# Altium project PCB_Project.PrjPcb (part 4 of 5)
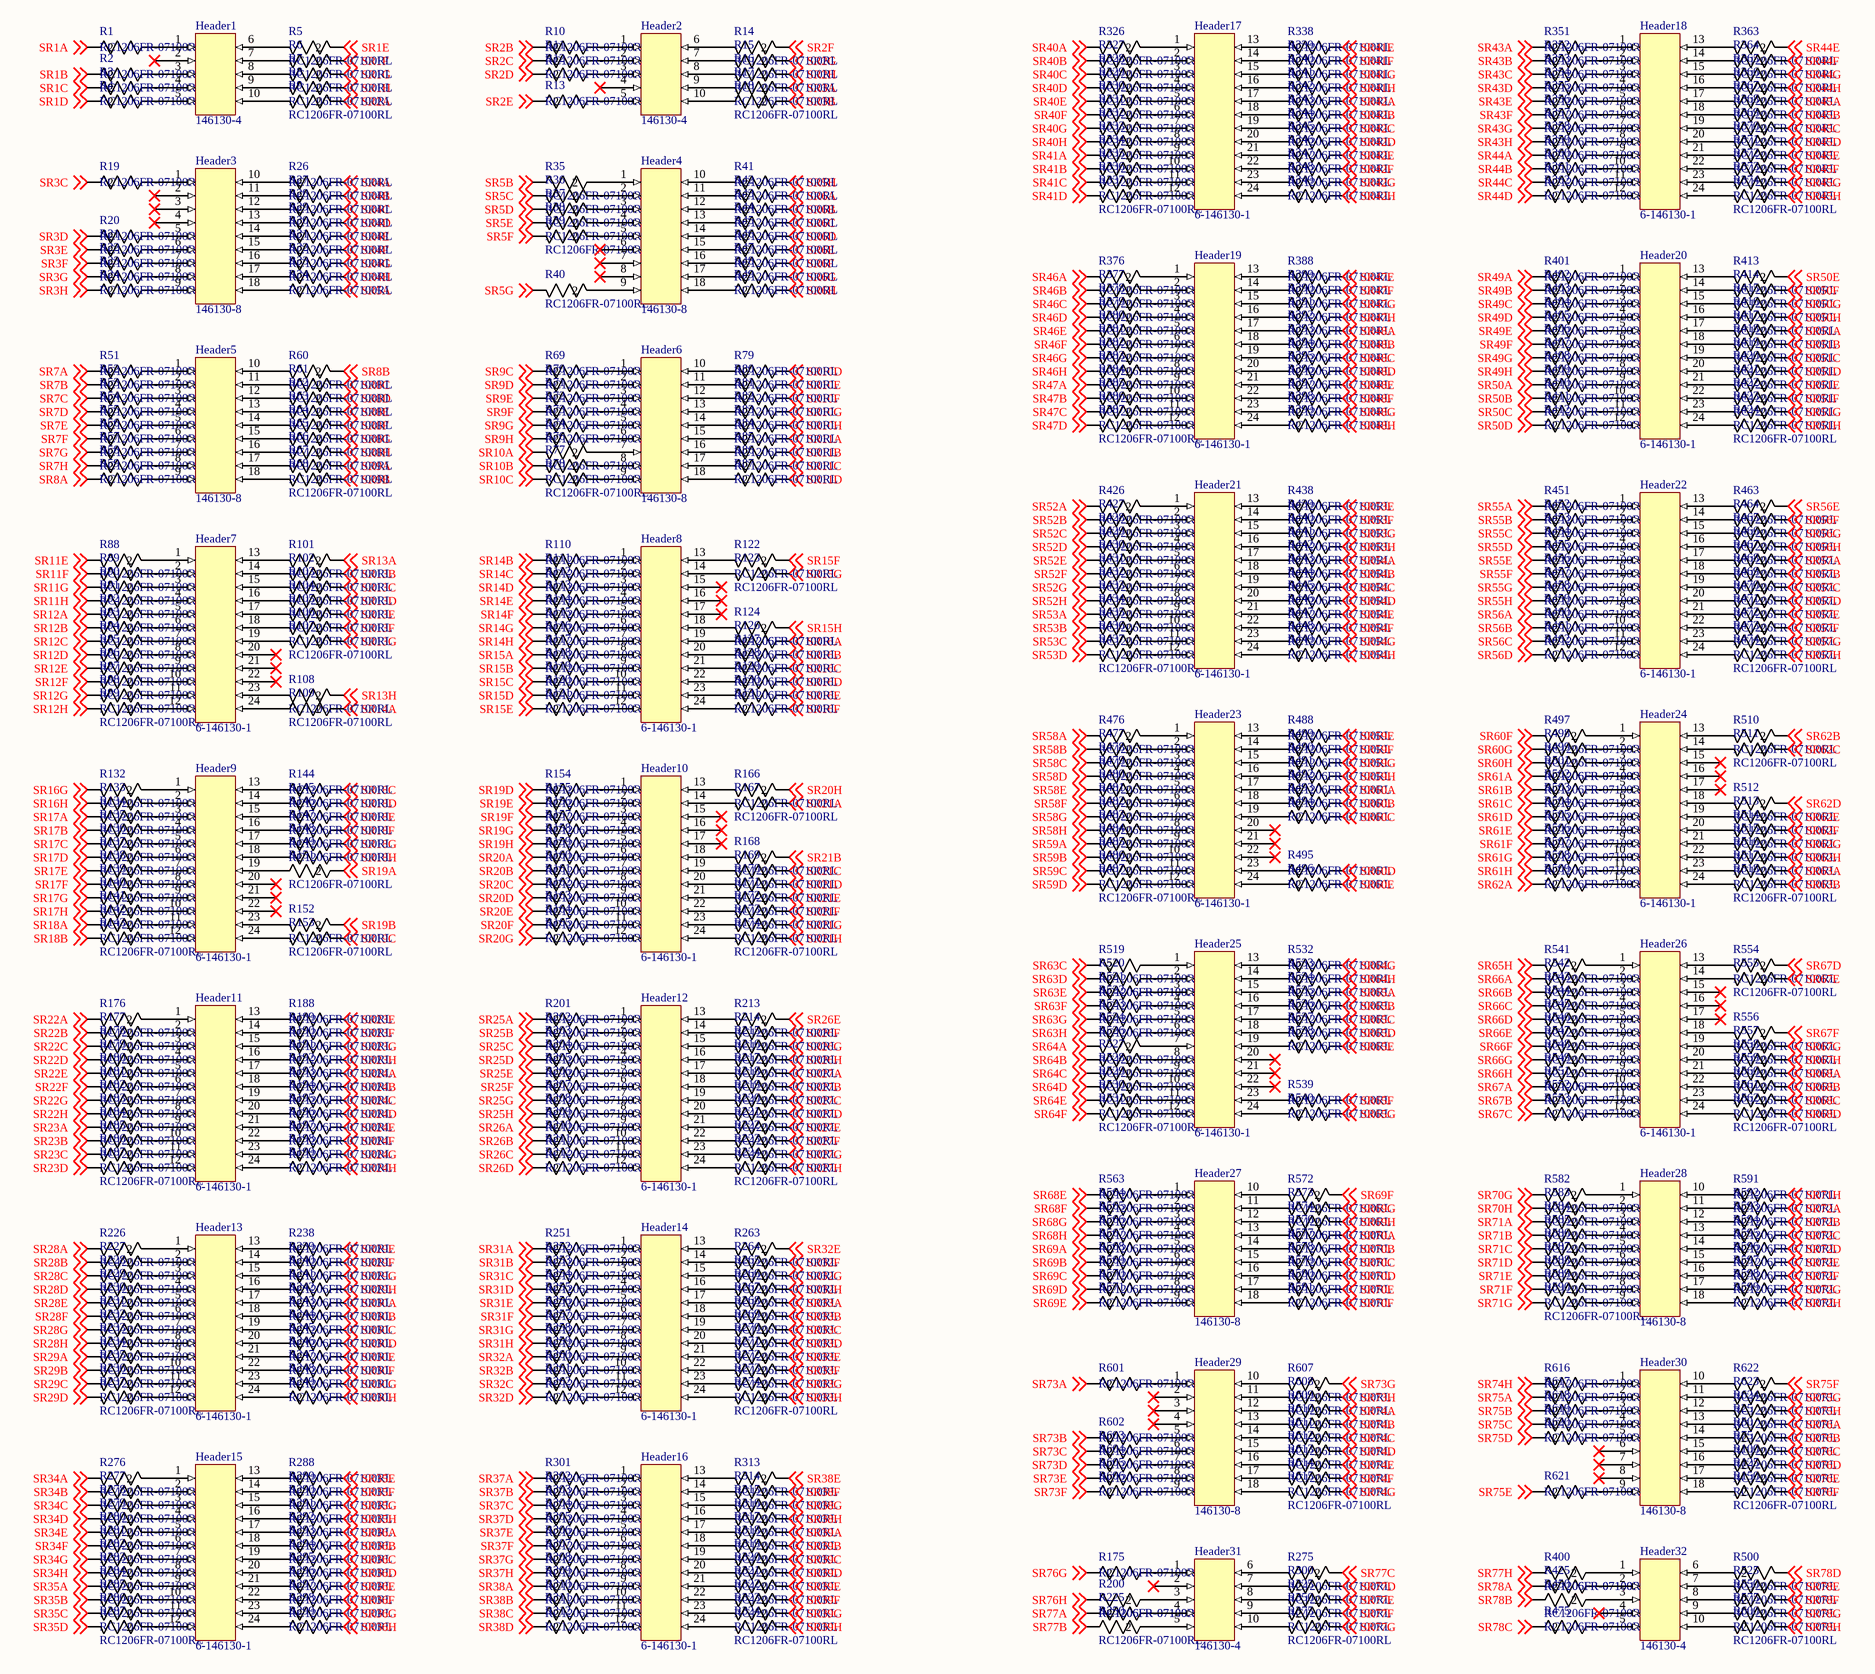
[diagram p9: digital_PIN_interface.SchDoc]

## Sheet digital_PIN_interface.SchDoc (continued)

### Nets
SR1A: R1.2 ; off-sheet SR1A
SR1B: R2.2 ; off-sheet SR1B
SR1C: R3.2 ; off-sheet SR1C
SR1D: R4.2 ; off-sheet SR1D
SR1E: R5.2 ; off-sheet SR1E
SR1F: R6.2 ; off-sheet SR1F
SR1G: R7.2 ; off-sheet SR1G
SR1H: R8.2 ; off-sheet SR1H
SR2A: R9.2 ; off-sheet SR2A
SR2B: R10.2 ; off-sheet SR2B
SR2C: R11.2 ; off-sheet SR2C
SR2D: R12.2 ; off-sheet SR2D
SR2E: R13.2 ; off-sheet SR2E
SR2F: R14.2 ; off-sheet SR2F
SR2G: R15.2 ; off-sheet SR2G
SR2H: R16.2 ; off-sheet SR2H
SR3A: R17.2 ; off-sheet SR3A
SR3B: R18.2 ; off-sheet SR3B
SR3C: R19.2 ; off-sheet SR3C
SR3D: R20.2 ; off-sheet SR3D
SR3E: R21.2 ; off-sheet SR3E
SR3F: R22.2 ; off-sheet SR3F
SR3G: R23.2 ; off-sheet SR3G
SR3H: R24.2 ; off-sheet SR3H
SR4A: R26.1 ; off-sheet SR4A
SR4B: R27.1 ; off-sheet SR4B
SR4C: R28.1 ; off-sheet SR4C
SR4D: R29.1 ; off-sheet SR4D
SR4E: R30.1 ; off-sheet SR4E
SR4F: R31.1 ; off-sheet SR4F
SR4G: R32.1 ; off-sheet SR4G
SR4H: R33.1 ; off-sheet SR4H
SR5A: R34.1 ; off-sheet SR5A
SR5B: R35.1 ; off-sheet SR5B
SR5C: R36.1 ; off-sheet SR5C
SR5D: R37.1 ; off-sheet SR5D
SR5E: R38.1 ; off-sheet SR5E
SR5F: R39.1 ; off-sheet SR5F
SR5G: R40.1 ; off-sheet SR5G
SR5H: R41.1 ; off-sheet SR5H
SR6A: R42.1 ; off-sheet SR6A
SR6B: R43.1 ; off-sheet SR6B
SR6C: R44.1 ; off-sheet SR6C
SR6D: R45.1 ; off-sheet SR6D
SR6E: R46.1 ; off-sheet SR6E
SR6F: R47.1 ; off-sheet SR6F
SR6G: R48.1 ; off-sheet SR6G
SR6H: R49.1 ; off-sheet SR6H
SR7A: R51.2 ; off-sheet SR7A
SR7B: R52.2 ; off-sheet SR7B
SR7C: R53.2 ; off-sheet SR7C
SR7D: R54.2 ; off-sheet SR7D
SR7E: R55.2 ; off-sheet SR7E
SR7F: R56.2 ; off-sheet SR7F
SR7G: R57.2 ; off-sheet SR7G
SR7H: R58.2 ; off-sheet SR7H
SR8A: R59.2 ; off-sheet SR8A
SR8B: R60.2 ; off-sheet SR8B
SR8C: R61.2 ; off-sheet SR8C
SR8D: R62.2 ; off-sheet SR8D
SR8E: R63.2 ; off-sheet SR8E
SR8F: R64.2 ; off-sheet SR8F
SR8G: R65.2 ; off-sheet SR8G
SR8H: R66.2 ; off-sheet SR8H
SR9A: R67.2 ; off-sheet SR9A
SR9B: R68.2 ; off-sheet SR9B
SR9C: R69.2 ; off-sheet SR9C
SR9D: R70.2 ; off-sheet SR9D
SR9E: R71.2 ; off-sheet SR9E
SR9F: R72.2 ; off-sheet SR9F
SR9G: R73.2 ; off-sheet SR9G
SR9H: R74.2 ; off-sheet SR9H
SR10A: R76.1 ; off-sheet SR10A
SR10B: R77.1 ; off-sheet SR10B
SR10C: R78.1 ; off-sheet SR10C
SR10D: R79.1 ; off-sheet SR10D
SR10E: R80.1 ; off-sheet SR10E
SR10F: R81.1 ; off-sheet SR10F
SR10G: R82.1 ; off-sheet SR10G
SR10H: R83.1 ; off-sheet SR10H
SR11A: R84.1 ; off-sheet SR11A
SR11B: R85.1 ; off-sheet SR11B
SR11C: R86.1 ; off-sheet SR11C
SR11D: R87.1 ; off-sheet SR11D
SR11E: R88.1 ; off-sheet SR11E
SR11F: R89.1 ; off-sheet SR11F
SR11G: R90.1 ; off-sheet SR11G
SR11H: R91.1 ; off-sheet SR11H
SR12A: R92.1 ; off-sheet SR12A
SR12B: R93.1 ; off-sheet SR12B
SR12C: R94.1 ; off-sheet SR12C
SR12D: R95.1 ; off-sheet SR12D
SR12E: R96.1 ; off-sheet SR12E
SR12F: R97.1 ; off-sheet SR12F
SR12G: R98.1 ; off-sheet SR12G
SR12H: R99.1 ; off-sheet SR12H
SR13A: R101.2 ; off-sheet SR13A
SR13B: R102.2 ; off-sheet SR13B
SR13C: R103.2 ; off-sheet SR13C
SR13D: R104.2 ; off-sheet SR13D
SR13E: R105.2 ; off-sheet SR13E
SR13F: R106.2 ; off-sheet SR13F
SR13G: R107.2 ; off-sheet SR13G
SR13H: R108.2 ; off-sheet SR13H
SR14A: R109.2 ; off-sheet SR14A
SR14B: R110.2 ; off-sheet SR14B
SR14C: R111.2 ; off-sheet SR14C
SR14D: R112.2 ; off-sheet SR14D
SR14E: R113.2 ; off-sheet SR14E
SR14F: R114.2 ; off-sheet SR14F
SR14G: R115.2 ; off-sheet SR14G
SR14H: R116.2 ; off-sheet SR14H
SR15A: R117.2 ; off-sheet SR15A
SR15B: R118.2 ; off-sheet SR15B
SR15C: R119.2 ; off-sheet SR15C
SR15D: R120.2 ; off-sheet SR15D
SR15E: R121.2 ; off-sheet SR15E
SR15F: R122.2 ; off-sheet SR15F
SR15G: R123.2 ; off-sheet SR15G
SR15H: R124.2 ; off-sheet SR15H
SR16A: R126.1 ; off-sheet SR16A
SR16B: R127.1 ; off-sheet SR16B
SR16C: R128.1 ; off-sheet SR16C
SR16D: R129.1 ; off-sheet SR16D
SR16E: R130.1 ; off-sheet SR16E
SR16F: R131.1 ; off-sheet SR16F
SR16G: R132.1 ; off-sheet SR16G
SR16H: R133.1 ; off-sheet SR16H
SR17A: R134.1 ; off-sheet SR17A
SR17B: R135.1 ; off-sheet SR17B
SR17C: R136.1 ; off-sheet SR17C
SR17D: R137.1 ; off-sheet SR17D
SR17E: R138.1 ; off-sheet SR17E
SR17F: R139.1 ; off-sheet SR17F
SR17G: R140.1 ; off-sheet SR17G
SR17H: R141.1 ; off-sheet SR17H
SR18A: R142.1 ; off-sheet SR18A
SR18B: R143.1 ; off-sheet SR18B
SR18C: R144.1 ; off-sheet SR18C
SR18D: R145.1 ; off-sheet SR18D
SR18E: R146.1 ; off-sheet SR18E
SR18F: R147.1 ; off-sheet SR18F
SR18G: R148.1 ; off-sheet SR18G
SR18H: R149.1 ; off-sheet SR18H
SR19A: R151.2 ; off-sheet SR19A
SR19B: R152.2 ; off-sheet SR19B
SR19C: R153.2 ; off-sheet SR19C
SR19D: R154.2 ; off-sheet SR19D
SR19E: R155.2 ; off-sheet SR19E
SR19F: R156.2 ; off-sheet SR19F
SR19G: R157.2 ; off-sheet SR19G
SR19H: R158.2 ; off-sheet SR19H
SR20A: R159.2 ; off-sheet SR20A
SR20B: R160.2 ; off-sheet SR20B
SR20C: R161.2 ; off-sheet SR20C
SR20D: R162.2 ; off-sheet SR20D
SR20E: R163.2 ; off-sheet SR20E
SR20F: R164.2 ; off-sheet SR20F
SR20G: R165.2 ; off-sheet SR20G
SR20H: R166.2 ; off-sheet SR20H
SR21A: R167.2 ; off-sheet SR21A
SR21B: R168.2 ; off-sheet SR21B
SR21C: R169.2 ; off-sheet SR21C
SR21D: R170.2 ; off-sheet SR21D
SR21E: R171.2 ; off-sheet SR21E
SR21F: R172.2 ; off-sheet SR21F
SR21G: R173.2 ; off-sheet SR21G
SR21H: R174.2 ; off-sheet SR21H
SR22A: R176.1 ; off-sheet SR22A
SR22B: R177.1 ; off-sheet SR22B
SR22C: R178.1 ; off-sheet SR22C
SR22D: R179.1 ; off-sheet SR22D
SR22E: R180.1 ; off-sheet SR22E
SR22F: R181.1 ; off-sheet SR22F
SR22G: R182.1 ; off-sheet SR22G
SR22H: R183.1 ; off-sheet SR22H
SR23A: R184.1 ; off-sheet SR23A
SR23B: R185.1 ; off-sheet SR23B
SR23C: R186.1 ; off-sheet SR23C
SR23D: R187.1 ; off-sheet SR23D
SR23E: R188.1 ; off-sheet SR23E
SR23F: R189.1 ; off-sheet SR23F
SR23G: R190.1 ; off-sheet SR23G
SR23H: R191.1 ; off-sheet SR23H
SR24A: R192.1 ; off-sheet SR24A
SR24B: R193.1 ; off-sheet SR24B
SR24C: R194.1 ; off-sheet SR24C
SR24D: R195.1 ; off-sheet SR24D
SR24E: R196.1 ; off-sheet SR24E
SR24F: R197.1 ; off-sheet SR24F
SR24G: R198.1 ; off-sheet SR24G
SR24H: R199.1 ; off-sheet SR24H
SR25A: R201.2 ; off-sheet SR25A
SR25B: R202.2 ; off-sheet SR25B
SR25C: R203.2 ; off-sheet SR25C
SR25D: R204.2 ; off-sheet SR25D
SR25E: R205.2 ; off-sheet SR25E
SR25F: R206.2 ; off-sheet SR25F
SR25G: R207.2 ; off-sheet SR25G
SR25H: R208.2 ; off-sheet SR25H
SR26A: R209.2 ; off-sheet SR26A
SR26B: R210.2 ; off-sheet SR26B
SR26C: R211.2 ; off-sheet SR26C
SR26D: R212.2 ; off-sheet SR26D
SR26E: R213.2 ; off-sheet SR26E
SR26F: R214.2 ; off-sheet SR26F
SR26G: R215.2 ; off-sheet SR26G
SR26H: R216.2 ; off-sheet SR26H
SR27A: R217.2 ; off-sheet SR27A
SR27B: R218.2 ; off-sheet SR27B
SR27C: R219.2 ; off-sheet SR27C
SR27D: R220.2 ; off-sheet SR27D
SR27E: R221.2 ; off-sheet SR27E
SR27F: R222.2 ; off-sheet SR27F
SR27G: R223.2 ; off-sheet SR27G
SR27H: R224.2 ; off-sheet SR27H
SR28A: R226.1 ; off-sheet SR28A
SR28B: R227.1 ; off-sheet SR28B
SR28C: R228.1 ; off-sheet SR28C
SR28D: R229.1 ; off-sheet SR28D
SR28E: R230.1 ; off-sheet SR28E
SR28F: R231.1 ; off-sheet SR28F
SR28G: R232.1 ; off-sheet SR28G
SR28H: R233.1 ; off-sheet SR28H
SR29A: R234.1 ; off-sheet SR29A
SR29B: R235.1 ; off-sheet SR29B
SR29C: R236.1 ; off-sheet SR29C
SR29D: R237.1 ; off-sheet SR29D
SR29E: R238.1 ; off-sheet SR29E
SR29F: R239.1 ; off-sheet SR29F
SR29G: R240.1 ; off-sheet SR29G
SR29H: R241.1 ; off-sheet SR29H
SR30A: R242.1 ; off-sheet SR30A
SR30B: R243.1 ; off-sheet SR30B
SR30C: R244.1 ; off-sheet SR30C
SR30D: R245.1 ; off-sheet SR30D
SR30E: R246.1 ; off-sheet SR30E
SR30F: R247.1 ; off-sheet SR30F
SR30G: R248.1 ; off-sheet SR30G
SR30H: R249.1 ; off-sheet SR30H
SR31A: R251.2 ; off-sheet SR31A
SR31B: R252.2 ; off-sheet SR31B
SR31C: R253.2 ; off-sheet SR31C
SR31D: R254.2 ; off-sheet SR31D
SR31E: R255.2 ; off-sheet SR31E
SR31F: R256.2 ; off-sheet SR31F
SR31G: R257.2 ; off-sheet SR31G
SR31H: R258.2 ; off-sheet SR31H
SR32A: R259.2 ; off-sheet SR32A
SR32B: R260.2 ; off-sheet SR32B
SR32C: R261.2 ; off-sheet SR32C
SR32D: R262.2 ; off-sheet SR32D
SR32E: R263.2 ; off-sheet SR32E
SR32F: R264.2 ; off-sheet SR32F
SR32G: R265.2 ; off-sheet SR32G
SR32H: R266.2 ; off-sheet SR32H
SR33A: R267.2 ; off-sheet SR33A
SR33B: R268.2 ; off-sheet SR33B
SR33C: R269.2 ; off-sheet SR33C
SR33D: R270.2 ; off-sheet SR33D
SR33E: R271.2 ; off-sheet SR33E
SR33F: R272.2 ; off-sheet SR33F
SR33G: R273.2 ; off-sheet SR33G
SR33H: R274.2 ; off-sheet SR33H
SR34A: R276.1 ; off-sheet SR34A
SR34B: R277.1 ; off-sheet SR34B
SR34C: R278.1 ; off-sheet SR34C
SR34D: R279.1 ; off-sheet SR34D
SR34E: R280.1 ; off-sheet SR34E
SR34F: R281.1 ; off-sheet SR34F
SR34G: R282.1 ; off-sheet SR34G
SR34H: R283.1 ; off-sheet SR34H
SR35A: R284.1 ; off-sheet SR35A
SR35B: R285.1 ; off-sheet SR35B
SR35C: R286.1 ; off-sheet SR35C
SR35D: R287.1 ; off-sheet SR35D
SR35E: R288.1 ; off-sheet SR35E
SR35F: R289.1 ; off-sheet SR35F
SR35G: R290.1 ; off-sheet SR35G
SR35H: R291.1 ; off-sheet SR35H
SR36A: R292.1 ; off-sheet SR36A
SR36B: R293.1 ; off-sheet SR36B
SR36C: R294.1 ; off-sheet SR36C
SR36D: R295.1 ; off-sheet SR36D
SR36E: R296.1 ; off-sheet SR36E
SR36F: R297.1 ; off-sheet SR36F
SR36G: R298.1 ; off-sheet SR36G
SR36H: R299.1 ; off-sheet SR36H
SR37A: R301.2 ; off-sheet SR37A
SR37B: R302.2 ; off-sheet SR37B
SR37C: R303.2 ; off-sheet SR37C
SR37D: R304.2 ; off-sheet SR37D
SR37E: R305.2 ; off-sheet SR37E
SR37F: R306.2 ; off-sheet SR37F
SR37G: R307.2 ; off-sheet SR37G
SR37H: R308.2 ; off-sheet SR37H
SR38A: R309.2 ; off-sheet SR38A
SR38B: R310.2 ; off-sheet SR38B
SR38C: R311.2 ; off-sheet SR38C
SR38D: R312.2 ; off-sheet SR38D
SR38E: R313.2 ; off-sheet SR38E
SR38F: R314.2 ; off-sheet SR38F
SR38G: R315.2 ; off-sheet SR38G
SR38H: R316.2 ; off-sheet SR38H
SR39A: R317.2 ; off-sheet SR39A
SR39B: R318.2 ; off-sheet SR39B
SR39C: R319.2 ; off-sheet SR39C
SR39D: R320.2 ; off-sheet SR39D
SR39E: R321.2 ; off-sheet SR39E
SR39F: R322.2 ; off-sheet SR39F
SR39G: R323.2 ; off-sheet SR39G
SR39H: R324.2 ; off-sheet SR39H
SR40A: R326.1 ; off-sheet SR40A
SR40B: R327.1 ; off-sheet SR40B
SR40C: R328.1 ; off-sheet SR40C
SR40D: R329.1 ; off-sheet SR40D
SR40E: R330.1 ; off-sheet SR40E
SR40F: R331.1 ; off-sheet SR40F
SR40G: R332.1 ; off-sheet SR40G
SR40H: R333.1 ; off-sheet SR40H
SR41A: R334.1 ; off-sheet SR41A
SR41B: R335.1 ; off-sheet SR41B
SR41C: R336.1 ; off-sheet SR41C
SR41D: R337.1 ; off-sheet SR41D
SR41E: R338.1 ; off-sheet SR41E
SR41F: R339.1 ; off-sheet SR41F
SR41G: R340.1 ; off-sheet SR41G
SR41H: R341.1 ; off-sheet SR41H
SR42A: R342.1 ; off-sheet SR42A
SR42B: R343.1 ; off-sheet SR42B
SR42C: R344.1 ; off-sheet SR42C
SR42D: R345.1 ; off-sheet SR42D
SR42E: R346.1 ; off-sheet SR42E
SR42F: R347.1 ; off-sheet SR42F
SR42G: R348.1 ; off-sheet SR42G
SR42H: R349.1 ; off-sheet SR42H
SR43A: R351.2 ; off-sheet SR43A
SR43B: R352.2 ; off-sheet SR43B
SR43C: R353.2 ; off-sheet SR43C
SR43D: R354.2 ; off-sheet SR43D
SR43E: R355.2 ; off-sheet SR43E
SR43F: R356.2 ; off-sheet SR43F
SR43G: R357.2 ; off-sheet SR43G
SR43H: R358.2 ; off-sheet SR43H
SR44A: R359.2 ; off-sheet SR44A
SR44B: R360.2 ; off-sheet SR44B
SR44C: R361.2 ; off-sheet SR44C
SR44D: R362.2 ; off-sheet SR44D
SR44E: R363.2 ; off-sheet SR44E
SR44F: R364.2 ; off-sheet SR44F
SR44G: R365.2 ; off-sheet SR44G
SR44H: R366.2 ; off-sheet SR44H
SR45A: R367.2 ; off-sheet SR45A
SR45B: R368.2 ; off-sheet SR45B
SR45C: R369.2 ; off-sheet SR45C
SR45D: R370.2 ; off-sheet SR45D
SR45E: R371.2 ; off-sheet SR45E
SR45F: R372.2 ; off-sheet SR45F
SR45G: R373.2 ; off-sheet SR45G
SR45H: R374.2 ; off-sheet SR45H
SR46A: R376.1 ; off-sheet SR46A
SR46B: R377.1 ; off-sheet SR46B
SR46C: R378.1 ; off-sheet SR46C
SR46D: R379.1 ; off-sheet SR46D
SR46E: R380.1 ; off-sheet SR46E
SR46F: R381.1 ; off-sheet SR46F
SR46G: R382.1 ; off-sheet SR46G
SR46H: R383.1 ; off-sheet SR46H
SR47A: R384.1 ; off-sheet SR47A
SR47B: R385.1 ; off-sheet SR47B
SR47C: R386.1 ; off-sheet SR47C
SR47D: R387.1 ; off-sheet SR47D
SR47E: R388.1 ; off-sheet SR47E
SR47F: R389.1 ; off-sheet SR47F
SR47G: R390.1 ; off-sheet SR47G
SR47H: R391.1 ; off-sheet SR47H
SR48A: R392.1 ; off-sheet SR48A
SR48B: R393.1 ; off-sheet SR48B
SR48C: R394.1 ; off-sheet SR48C
SR48D: R395.1 ; off-sheet SR48D
SR48E: R396.1 ; off-sheet SR48E
SR48F: R397.1 ; off-sheet SR48F
SR48G: R398.1 ; off-sheet SR48G
SR48H: R399.1 ; off-sheet SR48H
SR49A: R401.2 ; off-sheet SR49A
SR49B: R402.2 ; off-sheet SR49B
SR49C: R403.2 ; off-sheet SR49C
SR49D: R404.2 ; off-sheet SR49D
SR49E: R405.2 ; off-sheet SR49E
SR49F: R406.2 ; off-sheet SR49F
SR49G: R407.2 ; off-sheet SR49G
SR49H: R408.2 ; off-sheet SR49H
SR50A: R409.2 ; off-sheet SR50A
SR50B: R410.2 ; off-sheet SR50B
SR50C: R411.2 ; off-sheet SR50C
SR50D: R412.2 ; off-sheet SR50D
SR50E: R413.2 ; off-sheet SR50E
SR50F: R414.2 ; off-sheet SR50F
SR50G: R415.2 ; off-sheet SR50G
SR50H: R416.2 ; off-sheet SR50H
SR51A: R417.2 ; off-sheet SR51A
SR51B: R418.2 ; off-sheet SR51B
SR51C: R419.2 ; off-sheet SR51C
SR51D: R420.2 ; off-sheet SR51D
SR51E: R421.2 ; off-sheet SR51E
SR51F: R422.2 ; off-sheet SR51F
SR51G: R423.2 ; off-sheet SR51G
SR51H: R424.2 ; off-sheet SR51H
SR52A: R426.1 ; off-sheet SR52A
SR52B: R427.1 ; off-sheet SR52B
SR52C: R428.1 ; off-sheet SR52C
SR52D: R429.1 ; off-sheet SR52D
SR52E: R430.1 ; off-sheet SR52E
SR52F: R431.1 ; off-sheet SR52F
SR52G: R432.1 ; off-sheet SR52G
SR52H: R433.1 ; off-sheet SR52H
SR53A: R434.1 ; off-sheet SR53A
SR53B: R435.1 ; off-sheet SR53B
SR53C: R436.1 ; off-sheet SR53C
SR53D: R437.1 ; off-sheet SR53D
SR53E: R438.1 ; off-sheet SR53E
SR53F: R439.1 ; off-sheet SR53F
SR53G: R440.1 ; off-sheet SR53G
SR53H: R441.1 ; off-sheet SR53H
SR54A: R442.1 ; off-sheet SR54A
SR54B: R443.1 ; off-sheet SR54B
SR54C: R444.1 ; off-sheet SR54C
SR54D: R445.1 ; off-sheet SR54D
SR54E: R446.1 ; off-sheet SR54E
SR54F: R447.1 ; off-sheet SR54F
SR54G: R448.1 ; off-sheet SR54G
SR54H: R449.1 ; off-sheet SR54H
SR55A: R451.2 ; off-sheet SR55A
SR55B: R452.2 ; off-sheet SR55B
SR55C: R453.2 ; off-sheet SR55C
SR55D: R454.2 ; off-sheet SR55D
SR55E: R455.2 ; off-sheet SR55E
SR55F: R456.2 ; off-sheet SR55F
SR55G: R457.2 ; off-sheet SR55G
SR55H: R458.2 ; off-sheet SR55H
SR56A: R459.2 ; off-sheet SR56A
SR56B: R460.2 ; off-sheet SR56B
SR56C: R461.2 ; off-sheet SR56C
SR56D: R462.2 ; off-sheet SR56D
SR56E: R463.2 ; off-sheet SR56E
SR56F: R464.2 ; off-sheet SR56F
SR56G: R465.2 ; off-sheet SR56G
SR56H: R466.2 ; off-sheet SR56H
SR57A: R467.2 ; off-sheet SR57A
SR57B: R468.2 ; off-sheet SR57B
SR57C: R469.2 ; off-sheet SR57C
SR57D: R470.2 ; off-sheet SR57D
SR57E: R471.2 ; off-sheet SR57E
SR57F: R472.2 ; off-sheet SR57F
SR57G: R473.2 ; off-sheet SR57G
SR57H: R474.2 ; off-sheet SR57H
SR58A: R476.1 ; off-sheet SR58A
SR58B: R477.1 ; off-sheet SR58B
SR58C: R478.1 ; off-sheet SR58C
SR58D: R479.1 ; off-sheet SR58D
SR58E: R480.1 ; off-sheet SR58E
SR58F: R481.1 ; off-sheet SR58F
SR58G: R482.1 ; off-sheet SR58G
SR58H: R483.1 ; off-sheet SR58H
SR59A: R484.1 ; off-sheet SR59A
SR59B: R485.1 ; off-sheet SR59B
SR59C: R486.1 ; off-sheet SR59C
SR59D: R487.1 ; off-sheet SR59D
SR59E: R488.1 ; off-sheet SR59E
SR59F: R489.1 ; off-sheet SR59F
SR59G: R490.1 ; off-sheet SR59G
SR59H: R491.1 ; off-sheet SR59H
SR60A: R492.1 ; off-sheet SR60A
SR60B: R493.1 ; off-sheet SR60B
SR60C: R494.1 ; off-sheet SR60C
SR60D: R495.1 ; off-sheet SR60D
SR60E: R496.1 ; off-sheet SR60E
SR60F: R497.1 ; off-sheet SR60F
SR60G: R498.1 ; off-sheet SR60G
SR60H: R499.1 ; off-sheet SR60H
SR61A: R501.2 ; off-sheet SR61A
SR61B: R502.2 ; off-sheet SR61B
SR61C: R503.2 ; off-sheet SR61C
SR61D: R504.2 ; off-sheet SR61D
SR61E: R505.2 ; off-sheet SR61E
SR61F: R506.2 ; off-sheet SR61F
SR61G: R507.2 ; off-sheet SR61G
SR61H: R508.2 ; off-sheet SR61H
SR62A: R509.2 ; off-sheet SR62A
SR62B: R510.2 ; off-sheet SR62B
SR62C: R511.2 ; off-sheet SR62C
SR62D: R512.2 ; off-sheet SR62D
SR62E: R513.2 ; off-sheet SR62E
SR62F: R514.2 ; off-sheet SR62F
SR62G: R515.2 ; off-sheet SR62G
SR62H: R516.2 ; off-sheet SR62H
SR63A: R517.2 ; off-sheet SR63A
SR63B: R518.2 ; off-sheet SR63B
SR63C: R519.2 ; off-sheet SR63C
SR63D: R520.2 ; off-sheet SR63D
SR63E: R521.2 ; off-sheet SR63E
SR63F: R522.2 ; off-sheet SR63F
SR63G: R523.2 ; off-sheet SR63G
SR63H: R524.2 ; off-sheet SR63H
SR64A: R526.1 ; off-sheet SR64A
SR64B: R527.1 ; off-sheet SR64B
SR64C: R528.1 ; off-sheet SR64C
SR64D: R529.1 ; off-sheet SR64D
SR64E: R530.1 ; off-sheet SR64E
SR64F: R531.1 ; off-sheet SR64F
SR64G: R532.1 ; off-sheet SR64G
SR64H: R533.1 ; off-sheet SR64H
SR65A: R534.1 ; off-sheet SR65A
SR65B: R535.1 ; off-sheet SR65B
SR65C: R536.1 ; off-sheet SR65C
SR65D: R537.1 ; off-sheet SR65D
SR65E: R538.1 ; off-sheet SR65E
SR65F: R539.1 ; off-sheet SR65F
SR65G: R540.1 ; off-sheet SR65G
SR65H: R541.1 ; off-sheet SR65H
SR66A: R542.1 ; off-sheet SR66A
SR66B: R543.1 ; off-sheet SR66B
SR66C: R544.1 ; off-sheet SR66C
SR66D: R545.1 ; off-sheet SR66D
SR66E: R546.1 ; off-sheet SR66E
SR66F: R547.1 ; off-sheet SR66F
SR66G: R548.1 ; off-sheet SR66G
SR66H: R549.1 ; off-sheet SR66H
SR67A: R551.2 ; off-sheet SR67A
SR67B: R552.2 ; off-sheet SR67B
SR67C: R553.2 ; off-sheet SR67C
SR67D: R554.2 ; off-sheet SR67D
SR67E: R555.2 ; off-sheet SR67E
SR67F: R556.2 ; off-sheet SR67F
SR67G: R557.2 ; off-sheet SR67G
SR67H: R558.2 ; off-sheet SR67H
SR68A: R559.2 ; off-sheet SR68A
SR68B: R560.2 ; off-sheet SR68B
SR68C: R561.2 ; off-sheet SR68C
SR68D: R562.2 ; off-sheet SR68D
SR68E: R563.2 ; off-sheet SR68E
SR68F: R564.2 ; off-sheet SR68F
SR68G: R565.2 ; off-sheet SR68G
SR68H: R566.2 ; off-sheet SR68H
SR69A: R567.2 ; off-sheet SR69A
SR69B: R568.2 ; off-sheet SR69B
SR69C: R569.2 ; off-sheet SR69C
SR69D: R570.2 ; off-sheet SR69D
SR69E: R571.2 ; off-sheet SR69E
SR69F: R572.2 ; off-sheet SR69F
SR69G: R573.2 ; off-sheet SR69G
SR69H: R574.2 ; off-sheet SR69H
SR70A: R576.1 ; off-sheet SR70A
SR70B: R577.1 ; off-sheet SR70B
SR70C: R578.1 ; off-sheet SR70C
SR70D: R579.1 ; off-sheet SR70D
SR70E: R580.1 ; off-sheet SR70E
SR70F: R581.1 ; off-sheet SR70F
SR70G: R582.1 ; off-sheet SR70G
SR70H: R583.1 ; off-sheet SR70H
SR71A: R584.1 ; off-sheet SR71A
SR71B: R585.1 ; off-sheet SR71B
SR71C: R586.1 ; off-sheet SR71C
SR71D: R587.1 ; off-sheet SR71D
SR71E: R588.1 ; off-sheet SR71E
SR71F: R589.1 ; off-sheet SR71F
SR71G: R590.1 ; off-sheet SR71G
SR71H: R591.1 ; off-sheet SR71H
SR72A: R592.1 ; off-sheet SR72A
SR72B: R593.1 ; off-sheet SR72B
SR72C: R594.1 ; off-sheet SR72C
SR72D: R595.1 ; off-sheet SR72D
SR72E: R596.1 ; off-sheet SR72E
SR72F: R597.1 ; off-sheet SR72F
SR72G: R598.1 ; off-sheet SR72G
SR72H: R599.1 ; off-sheet SR72H
SR73A: R601.2 ; off-sheet SR73A
SR73B: R602.2 ; off-sheet SR73B
SR73C: R603.2 ; off-sheet SR73C
SR73D: R604.2 ; off-sheet SR73D
SR73E: R605.2 ; off-sheet SR73E
SR73F: R606.2 ; off-sheet SR73F
SR73G: R607.2 ; off-sheet SR73G
SR73H: R608.2 ; off-sheet SR73H
SR74A: R609.2 ; off-sheet SR74A
SR74B: R610.2 ; off-sheet SR74B
SR74C: R611.2 ; off-sheet SR74C
SR74D: R612.2 ; off-sheet SR74D
SR74E: R613.2 ; off-sheet SR74E
SR74F: R614.2 ; off-sheet SR74F
SR74G: R615.2 ; off-sheet SR74G
SR74H: R616.2 ; off-sheet SR74H
SR75A: R617.2 ; off-sheet SR75A
SR75B: R618.2 ; off-sheet SR75B
SR75C: R619.2 ; off-sheet SR75C
SR75D: R620.2 ; off-sheet SR75D
SR75E: R621.2 ; off-sheet SR75E
SR75F: R622.2 ; off-sheet SR75F
SR75G: R623.2 ; off-sheet SR75G
SR75H: R624.2 ; off-sheet SR75H
SR76A: R25.2 ; off-sheet SR76A
SR76B: R50.1 ; off-sheet SR76B
SR76C: R75.2 ; off-sheet SR76C
SR76D: R100.1 ; off-sheet SR76D
SR76E: R125.2 ; off-sheet SR76E
SR76F: R150.1 ; off-sheet SR76F
SR76G: R175.2 ; off-sheet SR76G
SR76H: R200.1 ; off-sheet SR76H
SR77A: R225.2 ; off-sheet SR77A
SR77B: R250.1 ; off-sheet SR77B
SR77C: R275.2 ; off-sheet SR77C
SR77D: R300.1 ; off-sheet SR77D
SR77E: R325.2 ; off-sheet SR77E
SR77F: R350.1 ; off-sheet SR77F
SR77G: R375.2 ; off-sheet SR77G
SR77H: R400.1 ; off-sheet SR77H
SR78A: R425.2 ; off-sheet SR78A
SR78B: R450.1 ; off-sheet SR78B
SR78C: R475.2 ; off-sheet SR78C
SR78D: R500.1 ; off-sheet SR78D
SR78E: R525.2 ; off-sheet SR78E
SR78F: R550.1 ; off-sheet SR78F
SR78G: R575.2 ; off-sheet SR78G
SR78H: R600.1 ; off-sheet SR78H
NetHeader1_1: Header1.1 R1.1
NetHeader1_3: Header1.3 R2.1
NetHeader1_4: Header1.4 R3.1
NetHeader1_5: Header1.5 R4.1
NetHeader1_6: Header1.6 R5.1
NetHeader1_7: Header1.7 R6.1
NetHeader1_8: Header1.8 R7.1
NetHeader1_9: Header1.9 R8.1
NetHeader1_10: Header1.10 R9.1
NetHeader2_1: Header2.1 R10.1
NetHeader2_2: Header2.2 R11.1
NetHeader2_3: Header2.3 R12.1
NetHeader2_5: Header2.5 R13.1
NetHeader2_6: Header2.6 R14.1
NetHeader2_7: Header2.7 R15.1
NetHeader2_8: Header2.8 R16.1
NetHeader2_9: Header2.9 R17.1
NetHeader2_10: Header2.10 R18.1
NetHeader3_1: Header3.1 R19.1
NetHeader3_5: Header3.5 R20.1
NetHeader3_6: Header3.6 R21.1
NetHeader3_7: Header3.7 R22.1
NetHeader3_8: Header3.8 R23.1
NetHeader3_9: Header3.9 R24.1
NetHeader3_10: Header3.10 R26.2
NetHeader3_11: Header3.11 R27.2
NetHeader3_12: Header3.12 R28.2
NetHeader3_13: Header3.13 R29.2
NetHeader3_14: Header3.14 R30.2
NetHeader3_15: Header3.15 R31.2
NetHeader3_16: Header3.16 R32.2
NetHeader3_17: Header3.17 R33.2
NetHeader3_18: Header3.18 R34.2
NetHeader4_1: Header4.1 R35.2
NetHeader4_2: Header4.2 R36.2
NetHeader4_3: Header4.3 R37.2
NetHeader4_4: Header4.4 R38.2
NetHeader4_5: Header4.5 R39.2
NetHeader4_9: Header4.9 R40.2
NetHeader4_10: Header4.10 R41.2
NetHeader4_11: Header4.11 R42.2
NetHeader4_12: Header4.12 R43.2
NetHeader4_13: Header4.13 R44.2
NetHeader4_14: Header4.14 R45.2
NetHeader4_15: Header4.15 R46.2
NetHeader4_16: Header4.16 R47.2
NetHeader4_17: Header4.17 R48.2
NetHeader4_18: Header4.18 R49.2
NetHeader5_1: Header5.1 R51.1
NetHeader5_2: Header5.2 R52.1
NetHeader5_3: Header5.3 R53.1
NetHeader5_4: Header5.4 R54.1
NetHeader5_5: Header5.5 R55.1
NetHeader5_6: Header5.6 R56.1
NetHeader5_7: Header5.7 R57.1
NetHeader5_8: Header5.8 R58.1
NetHeader5_9: Header5.9 R59.1
NetHeader5_10: Header5.10 R60.1
NetHeader5_11: Header5.11 R61.1
NetHeader5_12: Header5.12 R62.1
NetHeader5_13: Header5.13 R63.1
NetHeader5_14: Header5.14 R64.1
NetHeader5_15: Header5.15 R65.1
NetHeader5_16: Header5.16 R66.1
NetHeader5_17: Header5.17 R67.1
NetHeader5_18: Header5.18 R68.1
NetHeader6_1: Header6.1 R69.1
NetHeader6_2: Header6.2 R70.1
NetHeader6_3: Header6.3 R71.1
NetHeader6_4: Header6.4 R72.1
NetHeader6_5: Header6.5 R73.1
NetHeader6_6: Header6.6 R74.1
NetHeader6_7: Header6.7 R76.2
NetHeader6_8: Header6.8 R77.2
NetHeader6_9: Header6.9 R78.2
NetHeader6_10: Header6.10 R79.2
NetHeader6_11: Header6.11 R80.2
NetHeader6_12: Header6.12 R81.2
NetHeader6_13: Header6.13 R82.2
NetHeader6_14: Header6.14 R83.2
NetHeader6_15: Header6.15 R84.2
NetHeader6_16: Header6.16 R85.2
NetHeader6_17: Header6.17 R86.2
NetHeader6_18: Header6.18 R87.2
NetHeader7_1: Header7.1 R88.2
NetHeader7_2: Header7.2 R89.2
NetHeader7_3: Header7.3 R90.2
NetHeader7_4: Header7.4 R91.2
NetHeader7_5: Header7.5 R92.2
NetHeader7_6: Header7.6 R93.2
NetHeader7_7: Header7.7 R94.2
NetHeader7_8: Header7.8 R95.2
NetHeader7_9: Header7.9 R96.2
NetHeader7_10: Header7.10 R97.2
NetHeader7_11: Header7.11 R98.2
NetHeader7_12: Header7.12 R99.2
NetHeader7_13: Header7.13 R101.1
NetHeader7_14: Header7.14 R102.1
NetHeader7_15: Header7.15 R103.1
NetHeader7_16: Header7.16 R104.1
NetHeader7_17: Header7.17 R105.1
NetHeader7_18: Header7.18 R106.1
NetHeader7_19: Header7.19 R107.1
NetHeader7_23: Header7.23 R108.1
NetHeader7_24: Header7.24 R109.1
NetHeader8_1: Header8.1 R110.1
NetHeader8_2: Header8.2 R111.1
NetHeader8_3: Header8.3 R112.1
NetHeader8_4: Header8.4 R113.1
NetHeader8_5: Header8.5 R114.1
NetHeader8_6: Header8.6 R115.1
NetHeader8_7: Header8.7 R116.1
NetHeader8_8: Header8.8 R117.1
NetHeader8_9: Header8.9 R118.1
NetHeader8_10: Header8.10 R119.1
NetHeader8_11: Header8.11 R120.1
NetHeader8_12: Header8.12 R121.1
NetHeader8_13: Header8.13 R122.1
NetHeader8_14: Header8.14 R123.1
NetHeader8_18: Header8.18 R124.1
NetHeader8_19: Header8.19 R126.2
NetHeader8_20: Header8.20 R127.2
NetHeader8_21: Header8.21 R128.2
NetHeader8_22: Header8.22 R129.2
NetHeader8_23: Header8.23 R130.2
NetHeader8_24: Header8.24 R131.2
NetHeader9_1: Header9.1 R132.2
NetHeader9_2: Header9.2 R133.2
NetHeader9_3: Header9.3 R134.2
NetHeader9_4: Header9.4 R135.2
NetHeader9_5: Header9.5 R136.2
NetHeader9_6: Header9.6 R137.2
NetHeader9_7: Header9.7 R138.2
NetHeader9_8: Header9.8 R139.2
NetHeader9_9: Header9.9 R140.2
NetHeader9_10: Header9.10 R141.2
NetHeader9_11: Header9.11 R142.2
NetHeader9_12: Header9.12 R143.2
NetHeader9_13: Header9.13 R144.2
NetHeader9_14: Header9.14 R145.2
NetHeader9_15: Header9.15 R146.2
NetHeader9_16: Header9.16 R147.2
NetHeader9_17: Header9.17 R148.2
NetHeader9_18: Header9.18 R149.2
NetHeader9_19: Header9.19 R151.1
NetHeader9_23: Header9.23 R152.1
NetHeader9_24: Header9.24 R153.1
NetHeader10_1: Header10.1 R154.1
NetHeader10_2: Header10.2 R155.1
NetHeader10_3: Header10.3 R156.1
NetHeader10_4: Header10.4 R157.1
NetHeader10_5: Header10.5 R158.1
NetHeader10_6: Header10.6 R159.1
NetHeader10_7: Header10.7 R160.1
NetHeader10_8: Header10.8 R161.1
NetHeader10_9: Header10.9 R162.1
NetHeader10_10: Header10.10 R163.1
NetHeader10_11: Header10.11 R164.1
NetHeader10_12: Header10.12 R165.1
NetHeader10_13: Header10.13 R166.1
NetHeader10_14: Header10.14 R167.1
NetHeader10_18: Header10.18 R168.1
NetHeader10_19: Header10.19 R169.1
NetHeader10_20: Header10.20 R170.1
NetHeader10_21: Header10.21 R171.1
NetHeader10_22: Header10.22 R172.1
NetHeader10_23: Header10.23 R173.1
NetHeader10_24: Header10.24 R174.1
NetHeader11_1: Header11.1 R176.2
NetHeader11_2: Header11.2 R177.2
NetHeader11_3: Header11.3 R178.2
NetHeader11_4: Header11.4 R179.2
NetHeader11_5: Header11.5 R180.2
NetHeader11_6: Header11.6 R181.2
NetHeader11_7: Header11.7 R182.2
NetHeader11_8: Header11.8 R183.2
NetHeader11_9: Header11.9 R184.2
NetHeader11_10: Header11.10 R185.2
NetHeader11_11: Header11.11 R186.2
NetHeader11_12: Header11.12 R187.2
NetHeader11_13: Header11.13 R188.2
NetHeader11_14: Header11.14 R189.2
NetHeader11_15: Header11.15 R190.2
NetHeader11_16: Header11.16 R191.2
NetHeader11_17: Header11.17 R192.2
NetHeader11_18: Header11.18 R193.2
NetHeader11_19: Header11.19 R194.2
NetHeader11_20: Header11.20 R195.2
NetHeader11_21: Header11.21 R196.2
NetHeader11_22: Header11.22 R197.2
NetHeader11_23: Header11.23 R198.2
NetHeader11_24: Header11.24 R199.2
NetHeader12_1: Header12.1 R201.1
NetHeader12_2: Header12.2 R202.1
NetHeader12_3: Header12.3 R203.1
NetHeader12_4: Header12.4 R204.1
NetHeader12_5: Header12.5 R205.1
NetHeader12_6: Header12.6 R206.1
NetHeader12_7: Header12.7 R207.1
NetHeader12_8: Header12.8 R208.1
NetHeader12_9: Header12.9 R209.1
NetHeader12_10: Header12.10 R210.1
NetHeader12_11: Header12.11 R211.1
NetHeader12_12: Header12.12 R212.1
NetHeader12_13: Header12.13 R213.1
NetHeader12_14: Header12.14 R214.1
NetHeader12_15: Header12.15 R215.1
NetHeader12_16: Header12.16 R216.1
NetHeader12_17: Header12.17 R217.1
NetHeader12_18: Header12.18 R218.1
NetHeader12_19: Header12.19 R219.1
NetHeader12_20: Header12.20 R220.1
NetHeader12_21: Header12.21 R221.1
NetHeader12_22: Header12.22 R222.1
NetHeader12_23: Header12.23 R223.1
NetHeader12_24: Header12.24 R224.1
NetHeader13_1: Header13.1 R226.2
NetHeader13_2: Header13.2 R227.2
NetHeader13_3: Header13.3 R228.2
NetHeader13_4: Header13.4 R229.2
NetHeader13_5: Header13.5 R230.2
NetHeader13_6: Header13.6 R231.2
NetHeader13_7: Header13.7 R232.2
NetHeader13_8: Header13.8 R233.2
NetHeader13_9: Header13.9 R234.2
NetHeader13_10: Header13.10 R235.2
NetHeader13_11: Header13.11 R236.2
NetHeader13_12: Header13.12 R237.2
NetHeader13_13: Header13.13 R238.2
NetHeader13_14: Header13.14 R239.2
NetHeader13_15: Header13.15 R240.2
NetHeader13_16: Header13.16 R241.2
NetHeader13_17: Header13.17 R242.2
NetHeader13_18: Header13.18 R243.2
NetHeader13_19: Header13.19 R244.2
NetHeader13_20: Header13.20 R245.2
NetHeader13_21: Header13.21 R246.2
NetHeader13_22: Header13.22 R247.2
NetHeader13_23: Header13.23 R248.2
NetHeader13_24: Header13.24 R249.2
NetHeader14_1: Header14.1 R251.1
NetHeader14_2: Header14.2 R252.1
NetHeader14_3: Header14.3 R253.1
NetHeader14_4: Header14.4 R254.1
NetHeader14_5: Header14.5 R255.1
NetHeader14_6: Header14.6 R256.1
NetHeader14_7: Header14.7 R257.1
NetHeader14_8: Header14.8 R258.1
NetHeader14_9: Header14.9 R259.1
NetHeader14_10: Header14.10 R260.1
NetHeader14_11: Header14.11 R261.1
NetHeader14_12: Header14.12 R262.1
NetHeader14_13: Header14.13 R263.1
NetHeader14_14: Header14.14 R264.1
NetHeader14_15: Header14.15 R265.1
NetHeader14_16: Header14.16 R266.1
NetHeader14_17: Header14.17 R267.1
NetHeader14_18: Header14.18 R268.1
NetHeader14_19: Header14.19 R269.1
NetHeader14_20: Header14.20 R270.1
NetHeader14_21: Header14.21 R271.1
NetHeader14_22: Header14.22 R272.1
NetHeader14_23: Header14.23 R273.1
NetHeader14_24: Header14.24 R274.1
NetHeader15_1: Header15.1 R276.2
NetHeader15_2: Header15.2 R277.2
NetHeader15_3: Header15.3 R278.2
NetHeader15_4: Header15.4 R279.2
NetHeader15_5: Header15.5 R280.2
NetHeader15_6: Header15.6 R281.2
NetHeader15_7: Header15.7 R282.2
NetHeader15_8: Header15.8 R283.2
NetHeader15_9: Header15.9 R284.2
NetHeader15_10: Header15.10 R285.2
NetHeader15_11: Header15.11 R286.2
NetHeader15_12: Header15.12 R287.2
NetHeader15_13: Header15.13 R288.2
NetHeader15_14: Header15.14 R289.2
NetHeader15_15: Header15.15 R290.2
NetHeader15_16: Header15.16 R291.2
NetHeader15_17: Header15.17 R292.2
NetHeader15_18: Header15.18 R293.2
NetHeader15_19: Header15.19 R294.2
NetHeader15_20: Header15.20 R295.2
NetHeader15_21: Header15.21 R296.2
NetHeader15_22: Header15.22 R297.2
NetHeader15_23: Header15.23 R298.2
NetHeader15_24: Header15.24 R299.2
NetHeader16_1: Header16.1 R301.1
NetHeader16_2: Header16.2 R302.1
NetHeader16_3: Header16.3 R303.1
NetHeader16_4: Header16.4 R304.1
NetHeader16_5: Header16.5 R305.1
NetHeader16_6: Header16.6 R306.1
NetHeader16_7: Header16.7 R307.1
NetHeader16_8: Header16.8 R308.1
NetHeader16_9: Header16.9 R309.1
NetHeader16_10: Header16.10 R310.1
NetHeader16_11: Header16.11 R311.1
NetHeader16_12: Header16.12 R312.1
NetHeader16_13: Header16.13 R313.1
NetHeader16_14: Header16.14 R314.1
NetHeader16_15: Header16.15 R315.1
NetHeader16_16: Header16.16 R316.1
NetHeader16_17: Header16.17 R317.1
NetHeader16_18: Header16.18 R318.1
NetHeader16_19: Header16.19 R319.1
NetHeader16_20: Header16.20 R320.1
NetHeader16_21: Header16.21 R321.1
NetHeader16_22: Header16.22 R322.1
NetHeader16_23: Header16.23 R323.1
NetHeader16_24: Header16.24 R324.1
NetHeader17_1: Header17.1 R326.2
NetHeader17_2: Header17.2 R327.2
NetHeader17_3: Header17.3 R328.2
NetHeader17_4: Header17.4 R329.2
NetHeader17_5: Header17.5 R330.2
NetHeader17_6: Header17.6 R331.2
NetHeader17_7: Header17.7 R332.2
NetHeader17_8: Header17.8 R333.2
NetHeader17_9: Header17.9 R334.2
NetHeader17_10: Header17.10 R335.2
NetHeader17_11: Header17.11 R336.2
NetHeader17_12: Header17.12 R337.2
NetHeader17_13: Header17.13 R338.2
NetHeader17_14: Header17.14 R339.2
NetHeader17_15: Header17.15 R340.2
NetHeader17_16: Header17.16 R341.2
NetHeader17_17: Header17.17 R342.2
NetHeader17_18: Header17.18 R343.2
NetHeader17_19: Header17.19 R344.2
NetHeader17_20: Header17.20 R345.2
NetHeader17_21: Header17.21 R346.2
NetHeader17_22: Header17.22 R347.2
NetHeader17_23: Header17.23 R348.2
NetHeader17_24: Header17.24 R349.2
NetHeader18_1: Header18.1 R351.1
NetHeader18_2: Header18.2 R352.1
NetHeader18_3: Header18.3 R353.1
NetHeader18_4: Header18.4 R354.1
NetHeader18_5: Header18.5 R355.1
NetHeader18_6: Header18.6 R356.1
NetHeader18_7: Header18.7 R357.1
NetHeader18_8: Header18.8 R358.1
NetHeader18_9: Header18.9 R359.1
NetHeader18_10: Header18.10 R360.1
NetHeader18_11: Header18.11 R361.1
NetHeader18_12: Header18.12 R362.1
NetHeader18_13: Header18.13 R363.1
NetHeader18_14: Header18.14 R364.1
NetHeader18_15: Header18.15 R365.1
NetHeader18_16: Header18.16 R366.1
NetHeader18_17: Header18.17 R367.1
NetHeader18_18: Header18.18 R368.1
NetHeader18_19: Header18.19 R369.1
NetHeader18_20: Header18.20 R370.1
NetHeader18_21: Header18.21 R371.1
NetHeader18_22: Header18.22 R372.1
NetHeader18_23: Header18.23 R373.1
NetHeader18_24: Header18.24 R374.1
NetHeader19_1: Header19.1 R376.2
NetHeader19_2: Header19.2 R377.2
NetHeader19_3: Header19.3 R378.2
NetHeader19_4: Header19.4 R379.2
NetHeader19_5: Header19.5 R380.2
NetHeader19_6: Header19.6 R381.2
NetHeader19_7: Header19.7 R382.2
NetHeader19_8: Header19.8 R383.2
NetHeader19_9: Header19.9 R384.2
NetHeader19_10: Header19.10 R385.2
NetHeader19_11: Header19.11 R386.2
NetHeader19_12: Header19.12 R387.2
NetHeader19_13: Header19.13 R388.2
NetHeader19_14: Header19.14 R389.2
NetHeader19_15: Header19.15 R390.2
NetHeader19_16: Header19.16 R391.2
NetHeader19_17: Header19.17 R392.2
NetHeader19_18: Header19.18 R393.2
NetHeader19_19: Header19.19 R394.2
NetHeader19_20: Header19.20 R395.2
NetHeader19_21: Header19.21 R396.2
NetHeader19_22: Header19.22 R397.2
NetHeader19_23: Header19.23 R398.2
NetHeader19_24: Header19.24 R399.2
NetHeader20_1: Header20.1 R401.1
NetHeader20_2: Header20.2 R402.1
NetHeader20_3: Header20.3 R403.1
NetHeader20_4: Header20.4 R404.1
NetHeader20_5: Header20.5 R405.1
NetHeader20_6: Header20.6 R406.1
NetHeader20_7: Header20.7 R407.1
NetHeader20_8: Header20.8 R408.1
NetHeader20_9: Header20.9 R409.1
NetHeader20_10: Header20.10 R410.1
NetHeader20_11: Header20.11 R411.1
NetHeader20_12: Header20.12 R412.1
NetHeader20_13: Header20.13 R413.1
NetHeader20_14: Header20.14 R414.1
NetHeader20_15: Header20.15 R415.1
NetHeader20_16: Header20.16 R416.1
NetHeader20_17: Header20.17 R417.1
NetHeader20_18: Header20.18 R418.1
NetHeader20_19: Header20.19 R419.1
NetHeader20_20: Header20.20 R420.1
NetHeader20_21: Header20.21 R421.1
NetHeader20_22: Header20.22 R422.1
NetHeader20_23: Header20.23 R423.1
NetHeader20_24: Header20.24 R424.1
NetHeader21_1: Header21.1 R426.2
NetHeader21_2: Header21.2 R427.2
NetHeader21_3: Header21.3 R428.2
NetHeader21_4: Header21.4 R429.2
NetHeader21_5: Header21.5 R430.2
NetHeader21_6: Header21.6 R431.2
NetHeader21_7: Header21.7 R432.2
NetHeader21_8: Header21.8 R433.2
NetHeader21_9: Header21.9 R434.2
NetHeader21_10: Header21.10 R435.2
NetHeader21_11: Header21.11 R436.2
NetHeader21_12: Header21.12 R437.2
NetHeader21_13: Header21.13 R438.2
NetHeader21_14: Header21.14 R439.2
NetHeader21_15: Header21.15 R440.2
NetHeader21_16: Header21.16 R441.2
NetHeader21_17: Header21.17 R442.2
NetHeader21_18: Header21.18 R443.2
NetHeader21_19: Header21.19 R444.2
NetHeader21_20: Header21.20 R445.2
NetHeader21_21: Header21.21 R446.2
NetHeader21_22: Header21.22 R447.2
NetHeader21_23: Header21.23 R448.2
NetHeader21_24: Header21.24 R449.2
NetHeader22_1: Header22.1 R451.1
NetHeader22_2: Header22.2 R452.1
NetHeader22_3: Header22.3 R453.1
NetHeader22_4: Header22.4 R454.1
NetHeader22_5: Header22.5 R455.1
NetHeader22_6: Header22.6 R456.1
NetHeader22_7: Header22.7 R457.1
NetHeader22_8: Header22.8 R458.1
NetHeader22_9: Header22.9 R459.1
NetHeader22_10: Header22.10 R460.1
NetHeader22_11: Header22.11 R461.1
NetHeader22_12: Header22.12 R462.1
NetHeader22_13: Header22.13 R463.1
NetHeader22_14: Header22.14 R464.1
NetHeader22_15: Header22.15 R465.1
NetHeader22_16: Header22.16 R466.1
NetHeader22_17: Header22.17 R467.1
NetHeader22_18: Header22.18 R468.1
NetHeader22_19: Header22.19 R469.1
NetHeader22_20: Header22.20 R470.1
NetHeader22_21: Header22.21 R471.1
NetHeader22_22: Header22.22 R472.1
NetHeader22_23: Header22.23 R473.1
NetHeader22_24: Header22.24 R474.1
NetHeader23_1: Header23.1 R476.2
NetHeader23_2: Header23.2 R477.2
NetHeader23_3: Header23.3 R478.2
NetHeader23_4: Header23.4 R479.2
NetHeader23_5: Header23.5 R480.2
NetHeader23_6: Header23.6 R481.2
NetHeader23_7: Header23.7 R482.2
NetHeader23_8: Header23.8 R483.2
NetHeader23_9: Header23.9 R484.2
NetHeader23_10: Header23.10 R485.2
NetHeader23_11: Header23.11 R486.2
NetHeader23_12: Header23.12 R487.2
NetHeader23_13: Header23.13 R488.2
NetHeader23_14: Header23.14 R489.2
NetHeader23_15: Header23.15 R490.2
NetHeader23_16: Header23.16 R491.2
NetHeader23_17: Header23.17 R492.2
NetHeader23_18: Header23.18 R493.2
NetHeader23_19: Header23.19 R494.2
NetHeader23_23: Header23.23 R495.2
NetHeader23_24: Header23.24 R496.2
NetHeader24_1: Header24.1 R497.2
NetHeader24_2: Header24.2 R498.2
NetHeader24_3: Header24.3 R499.2
NetHeader24_4: Header24.4 R501.1
NetHeader24_5: Header24.5 R502.1
NetHeader24_6: Header24.6 R503.1
NetHeader24_7: Header24.7 R504.1
NetHeader24_8: Header24.8 R505.1
NetHeader24_9: Header24.9 R506.1
NetHeader24_10: Header24.10 R507.1
NetHeader24_11: Header24.11 R508.1
NetHeader24_12: Header24.12 R509.1
NetHeader24_13: Header24.13 R510.1
NetHeader24_14: Header24.14 R511.1
NetHeader24_18: Header24.18 R512.1
NetHeader24_19: Header24.19 R513.1
NetHeader24_20: Header24.20 R514.1
NetHeader24_21: Header24.21 R515.1
NetHeader24_22: Header24.22 R516.1
NetHeader24_23: Header24.23 R517.1
NetHeader24_24: Header24.24 R518.1
NetHeader25_1: Header25.1 R519.1
NetHeader25_2: Header25.2 R520.1
NetHeader25_3: Header25.3 R521.1
NetHeader25_4: Header25.4 R522.1
NetHeader25_5: Header25.5 R523.1
NetHeader25_6: Header25.6 R524.1
NetHeader25_7: Header25.7 R526.2
NetHeader25_8: Header25.8 R527.2
NetHeader25_9: Header25.9 R528.2
NetHeader25_10: Header25.10 R529.2
NetHeader25_11: Header25.11 R530.2
NetHeader25_12: Header25.12 R531.2
NetHeader25_13: Header25.13 R532.2
NetHeader25_14: Header25.14 R533.2
NetHeader25_15: Header25.15 R534.2
NetHeader25_16: Header25.16 R535.2
NetHeader25_17: Header25.17 R536.2
NetHeader25_18: Header25.18 R537.2
NetHeader25_19: Header25.19 R538.2
NetHeader25_23: Header25.23 R539.2
NetHeader25_24: Header25.24 R540.2
NetHeader26_1: Header26.1 R541.2
NetHeader26_2: Header26.2 R542.2
NetHeader26_3: Header26.3 R543.2
NetHeader26_4: Header26.4 R544.2
NetHeader26_5: Header26.5 R545.2
NetHeader26_6: Header26.6 R546.2
NetHeader26_7: Header26.7 R547.2
NetHeader26_8: Header26.8 R548.2
NetHeader26_9: Header26.9 R549.2
NetHeader26_10: Header26.10 R551.1
NetHeader26_11: Header26.11 R552.1
NetHeader26_12: Header26.12 R553.1
NetHeader26_13: Header26.13 R554.1
NetHeader26_14: Header26.14 R555.1
NetHeader26_18: Header26.18 R556.1
NetHeader26_19: Header26.19 R557.1
NetHeader26_20: Header26.20 R558.1
NetHeader26_21: Header26.21 R559.1
NetHeader26_22: Header26.22 R560.1
NetHeader26_23: Header26.23 R561.1
NetHeader26_24: Header26.24 R562.1
NetHeader27_1: Header27.1 R563.1
NetHeader27_2: Header27.2 R564.1
NetHeader27_3: Header27.3 R565.1
NetHeader27_4: Header27.4 R566.1
NetHeader27_5: Header27.5 R567.1
NetHeader27_6: Header27.6 R568.1
NetHeader27_7: Header27.7 R569.1
NetHeader27_8: Header27.8 R570.1
NetHeader27_9: Header27.9 R571.1
NetHeader27_10: Header27.10 R572.1
NetHeader27_11: Header27.11 R573.1
NetHeader27_12: Header27.12 R574.1
NetHeader27_13: Header27.13 R576.2
NetHeader27_14: Header27.14 R577.2
NetHeader27_15: Header27.15 R578.2
NetHeader27_16: Header27.16 R579.2
NetHeader27_17: Header27.17 R580.2
NetHeader27_18: Header27.18 R581.2
NetHeader28_1: Header28.1 R582.2
NetHeader28_2: Header28.2 R583.2
NetHeader28_3: Header28.3 R584.2
NetHeader28_4: Header28.4 R585.2
NetHeader28_5: Header28.5 R586.2
NetHeader28_6: Header28.6 R587.2
NetHeader28_7: Header28.7 R588.2
NetHeader28_8: Header28.8 R589.2
NetHeader28_9: Header28.9 R590.2
NetHeader28_10: Header28.10 R591.2
NetHeader28_11: Header28.11 R592.2
NetHeader28_12: Header28.12 R593.2
NetHeader28_13: Header28.13 R594.2
NetHeader28_14: Header28.14 R595.2
NetHeader28_15: Header28.15 R596.2
NetHeader28_16: Header28.16 R597.2
NetHeader28_17: Header28.17 R598.2
NetHeader28_18: Header28.18 R599.2
NetHeader29_1: Header29.1 R601.1
NetHeader29_5: Header29.5 R602.1
NetHeader29_6: Header29.6 R603.1
NetHeader29_7: Header29.7 R604.1
NetHeader29_8: Header29.8 R605.1
NetHeader29_9: Header29.9 R606.1
NetHeader29_10: Header29.10 R607.1
NetHeader29_11: Header29.11 R608.1
NetHeader29_12: Header29.12 R609.1
NetHeader29_13: Header29.13 R610.1
NetHeader29_14: Header29.14 R611.1
NetHeader29_15: Header29.15 R612.1
NetHeader29_16: Header29.16 R613.1
NetHeader29_17: Header29.17 R614.1
NetHeader29_18: Header29.18 R615.1
NetHeader30_1: Header30.1 R616.1
NetHeader30_2: Header30.2 R617.1
NetHeader30_3: Header30.3 R618.1
NetHeader30_4: Header30.4 R619.1
NetHeader30_5: Header30.5 R620.1
NetHeader30_9: Header30.9 R621.1
NetHeader30_10: Header30.10 R622.1
NetHeader30_11: Header30.11 R623.1
NetHeader30_12: Header30.12 R624.1
NetHeader30_13: Header30.13 R25.1
NetHeader30_14: Header30.14 R50.2
NetHeader30_15: Header30.15 R75.1
NetHeader30_16: Header30.16 R100.2
NetHeader30_17: Header30.17 R125.1
NetHeader30_18: Header30.18 R150.2
NetHeader31_1: Header31.1 R175.1
NetHeader31_3: Header31.3 R200.2
NetHeader31_4: Header31.4 R225.1
NetHeader31_5: Header31.5 R250.2
NetHeader31_6: Header31.6 R275.1
NetHeader31_7: Header31.7 R300.2
NetHeader31_8: Header31.8 R325.1
NetHeader31_9: Header31.9 R350.2
NetHeader31_10: Header31.10 R375.1
NetHeader32_1: Header32.1 R400.2
NetHeader32_2: Header32.2 R425.1
NetHeader32_3: Header32.3 R450.2
NetHeader32_5: Header32.5 R475.1
NetHeader32_6: Header32.6 R500.2
NetHeader32_7: Header32.7 R525.1
NetHeader32_8: Header32.8 R550.2
NetHeader32_9: Header32.9 R575.1
NetHeader32_10: Header32.10 R600.2

Not connected (* = marked no-connect by the designer): Header1 2*; Header2 4*; Header3 2* 3* 4*; Header4 6* 7* 8*; Header7 20* 21* 22*; Header8 15* 16* 17*; Header9 20* 21* 22*; Header10 15* 16* 17*; Header23 20* 21* 22*; Header24 15* 16* 17*; Header25 20* 21* 22*; Header26 15* 16* 17*; Header29 2* 3* 4*; Header30 6* 7* 8*; Header31 2*; Header32 4*

### Library data of the parts
Header1 Header2 Header31 Header32 = 146130-4: 2*5 Header
Header3-Header6 Header27-Header30 = 146130-8: 2*9 Header
Header7-Header26 = 6-146130-1: 2*12 Header
R1-R624 = RC1206FR-07100RL: No Description Available; Mfr_Name: Yageo; Copyright: Copyright (C) 2022 Ultra Librarian. All rights reserved.; Manufacturer_Part_Number: RC1206FR-07100RL; Digi-Key_Part_Number_1: 311-100FRCT-ND; Digi-Key_Part_Number_2: 311-100FRDKR-ND; Digi-Key_Part_Number_3: 311-100FRTR-ND; Digi-Key_Part_Number_4: 311-100FRTR-NDL; RefDes: RefDes; Type: DEV